# EAGLE design stepper-motor-driver (EAGLE 5.02)
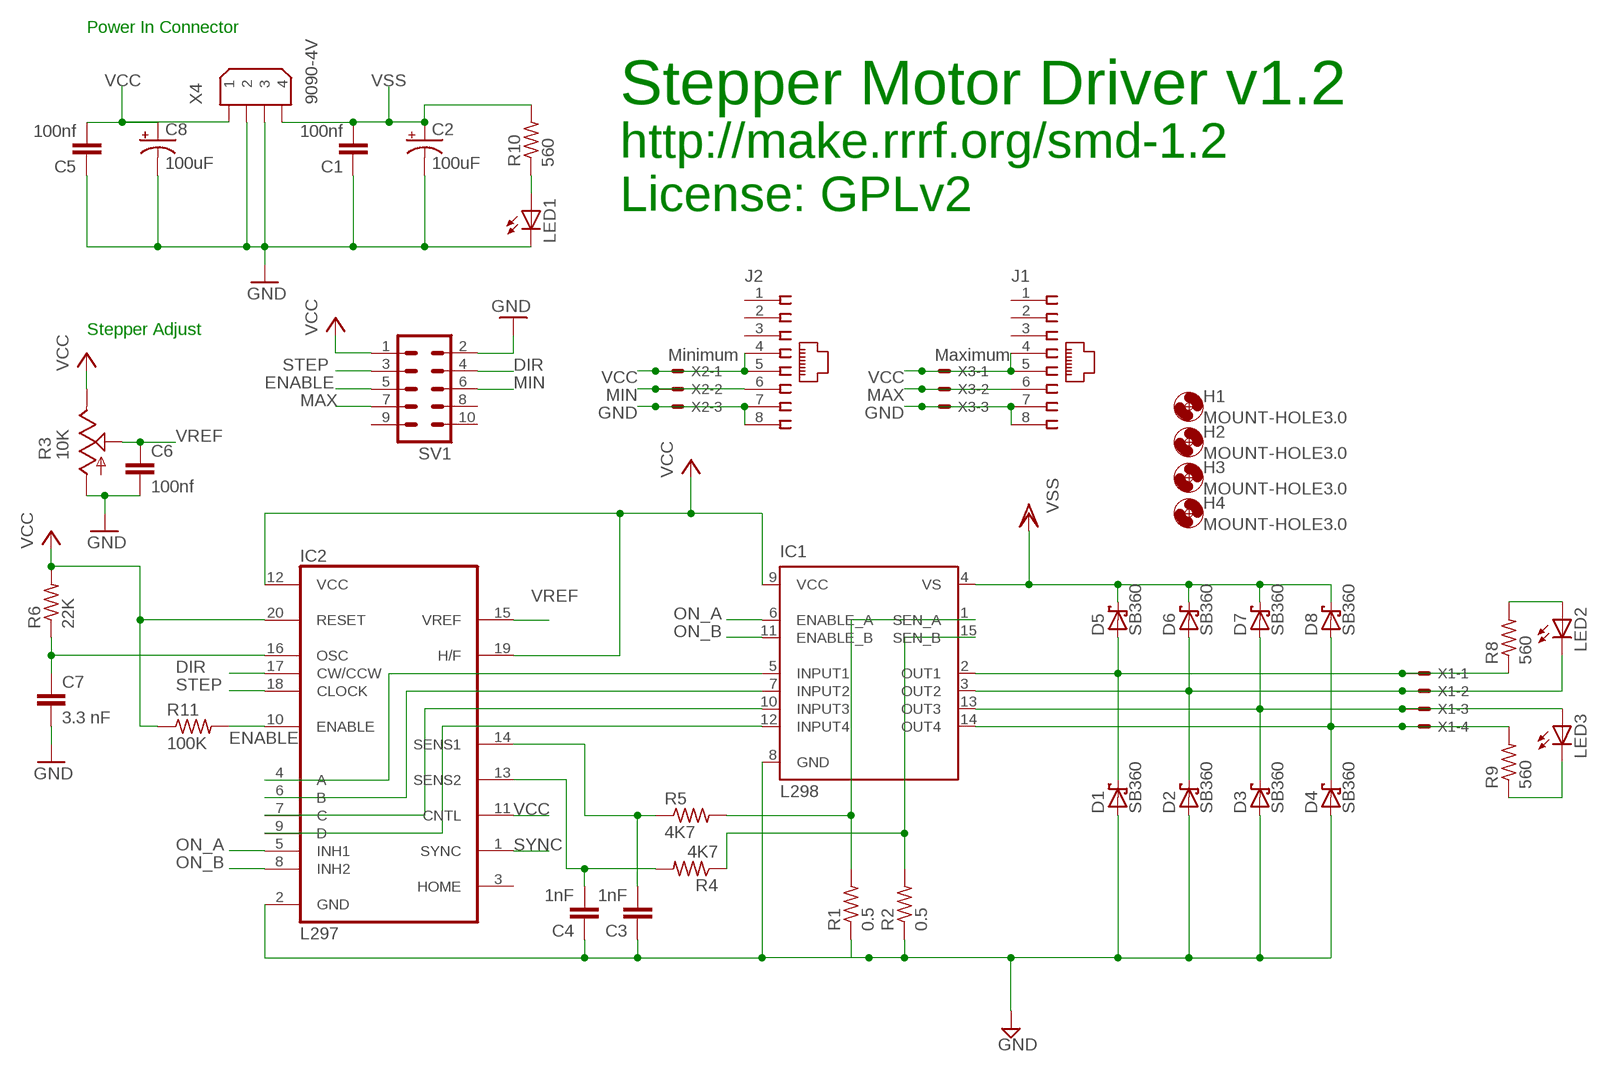
[diagram p0: schematic, sheet 1]

## Parts
C1  100nf  C-EU050-025X075  [C050-025X075]
C2  100uF  CPOL-USE5-6  [E5-6]
C3  1nF  C-EU050-030X075  [C050-030X075]
C4  1nF  C-EU050-030X075  [C050-030X075]
C5  100nf  C-EU050-025X075  [C050-025X075]
C6  100nf  C-EU050-035X075  [C050-035X075]
C7  3.3 nF  C5/2.5  [C5B2.5]
C8  100uF  CPOL-USE5-6  [E5-6]
D1  SB360  SCHOTTKY-DIODECB429-15  [CB429-15]
D2  SB360  SCHOTTKY-DIODECB429-15  [CB429-15]
D3  SB360  SCHOTTKY-DIODECB429-15  [CB429-15]
D4  SB360  SCHOTTKY-DIODECB429-15  [CB429-15]
D5  SB360  SCHOTTKY-DIODECB429-15  [CB429-15]
D6  SB360  SCHOTTKY-DIODECB429-15  [CB429-15]
D7  SB360  SCHOTTKY-DIODECB429-15  [CB429-15]
D8  SB360  SCHOTTKY-DIODECB429-15  [CB429-15]
H1  MOUNT-HOLE3.0  [3,0]
H2  MOUNT-HOLE3.0  [3,0]
H3  MOUNT-HOLE3.0  [3,0]
H4  MOUNT-HOLE3.0  [3,0]
IC1  L298  [MULTIWATT-15]
IC2  L297  [DIL20]
J1  520426-4  [520426-4]
J2  520426-4  [520426-4]
LED1  LED5MM  [LED5MM]
LED2  LED3MM  [LED3MM]
LED3  LED3MM  [LED3MM]
R1  0.5  R-US_0309/12  [0309/12]
R2  0.5  R-US_0309/12  [0309/12]
R3  10K  TRIM_US-B25U  [B25U]
R4  4K7  R-US_0207/7  [0207/7]
R5  4K7  R-US_0207/7  [0207/7]
R6  22K  R-US_0207/7  [0207/7]
R8  560  R-US_0207/7  [0207/7]
R9  560  R-US_0207/7  [0207/7]
R10  560  R-US_0207/7  [0207/7]
R11  100K  R-US_0207/7  [0207/7]
SV1  ML10  [ML10]
X1  KK-156-4  [KK-156-4]
X2  Minimum  22-23-2031  [22-23-2031]
X3  Maximum  22-23-2031  [22-23-2031]
X4  9090-4V  [9090-4V]

## Nets
DIR: IC2.17(CW/CCW) SV1.4
ENABLE: IC2.10(ENABLE) R11.2 SV1.5
GND [Ground]: C1.1 C2.- C3.1 C4.1 C5.1 C6.2 C7.2 C8.- D1.A D2.A D3.A D4.A IC1.8(GND) IC2.2(GND) J1.7 J1.8 J2.7 J2.8 LED1.K(C) R1.1 R2.1 R3.A SV1.2 X2.3 X3.3 X4.2 X4.3
MAX: J1.6 SV1.7 X3.2
MIN: J2.6 SV1.6 X2.2
N$2: LED3.K(C) R9.1
N$3: LED2.A R8.2
N$4: LED1.A R10.1
N$25: IC1.5(INPUT1) IC2.4(A)
N$26: IC1.7(INPUT2) IC2.6(B)
N$27 [Power]: D4.C D8.A IC1.14(OUT4) R9.2 X1.4
N$28 [Power]: D3.C D7.A IC1.13(OUT3) LED3.A X1.3
N$29 [Power]: D2.C D6.A IC1.3(OUT2) LED2.K(C) X1.2
N$30 [Power]: D1.C D5.A IC1.2(OUT1) R8.1 X1.1
N$31: IC1.10(INPUT3) IC2.7(C)
N$32 [Power]: IC1.15(SEN_B) R2.2 R4.1
N$33 [Power]: IC1.1(SEN_A) R1.2 R5.2
N$34: IC1.12(INPUT4) IC2.9(D)
N$36: C4.2 IC2.13(SENS2) R4.2
N$37: C3.2 IC2.14(SENS1) R5.1
ON_A: IC1.6(ENABLE_A) IC2.5(INH1)
ON_B: IC1.11(ENABLE_B) IC2.8(INH2)
OSC: C7.1 IC2.16(OSC) R6.1
STEP: IC2.18(CLOCK) SV1.3
SYNC: IC2.1(SYNC)
VCC: C5.2 C8.+ IC1.9(VCC) IC2.11(CNTL) IC2.12(VCC) IC2.19(H/F) IC2.20(RESET) J1.4 J1.5 J2.4 J2.5 R3.E R6.2 R11.1 SV1.1 X2.1 X3.1 X4.1
VREF: C6.1 IC2.15(VREF) R3.S
VSS [Power]: C1.2 C2.+ D5.C D6.C D7.C D8.C IC1.4(VS) R10.2 X4.4
Unconnected: IC2.3(HOME) J1.1 J1.2 J1.3 J2.1 J2.2 J2.3 SV1.8 SV1.9 SV1.10

## Notes on the sheet
- Power In Connector
- Stepper Motor Driver v1.2
- http://make.rrrf.org/smd-1.2
- License: GPLv2
- Stepper Adjust

## Library data of the parts
C1 C3-C6 = rcl:C-EU: CAPACITOR, European symbol
C2 C8 = rcl:CPOL-US: POLARIZED CAPACITOR, American symbol
C7 = capacitor-wima:C: CAPACITOR naming: grid - package width
D1-D8 = diode:SCHOTTKY-DIODE: Schottky Diode
H1-H4 = holes:MOUNT-HOLE: MOUNTING HOLE with drill center marker
IC1 = st-microelectronics:L298: DUAL FULL-BRIDGE DRIVER
IC2 = st-microelectronics:L297: STEPPER MOTOR CONTROLLER
J1 J2 = con-amp:520426-4: AMP connector
LED1-LED3 = led:LED: LED OSRAM: - CHIPLED LG R971, LG N971, LY N971, LG Q971, LY Q971, LO R971, LY R971 LH N974, LH R974 LS Q976, LO Q976, LY Q976 LO Q996 - Hyper CHIPLED LW Q18S LB Q993, LB Q99A, LB R99A - SideLED LS A670, LO A670, LY A670, LG A670, LP A670 LB A673, LV A673, LT A673, LW A673 LH A674 LY A675 LS A676, LA A676, LO A676, LY A676, LW A676 LS A679, LY A679, LG A679 - Hyper Micro SIDELED® LS Y876, LA Y876, LO Y876, LY Y876 LT Y87S - SmartLED LW L88C, LW L88S LB L89C, LB L89S, LG L890 LS L89K, LO L89K, LY L89K LS L896, LA L896, LO L896, LY L896 - TOPLED LS T670, LO T670, LY T670, LG T670, LP T670 LSG T670, LSP T670, LSY T670, LOP T670, LYG T670 LG T671, LOG T671, LSG T671 LB T673, LV T673, LT T673, LW T673 LH T674 LS T676, LA T676, LO T676, LY T676, LB T676, LH T676, LSB T676, LW T676 LB T67C, LV T67C, LT T67C, LS T67K, LO T67K, LY T67K, LW E67C LS E67B, LA E67B, LO E67B, LY E67B, LB E67C, LV E67C, LT E67C LW T67C LS T679, LY T679, LG T679 LS T770, LO T770, LY T770, LG T770, LP T770 LB T773, LV T773, LT T773, LW T773 LH T774 LS E675, LA E675, LY E675, LS T675 LS T776, LA T776, LO T776, LY T776, LB T776 LHGB T686 LT T68C, LB T68C - Hyper Mini TOPLED® LB M676 - Mini TOPLED Santana® LG M470 LS M47K, LO M47K, LY M47K Source: http://www.osram.convergy.de - LUMILED® LXK2-PW12-R00, LXK2-PW12-S00, LXK2-PW14-U00, LXK2-PW14-V00 LXK2-PM12-R00, LXK2-PM12-S00, LXK2-PM14-U00 LXK2-PE12-Q00, LXK2-PE12-R00, LXK2-PE12-S00, LXK2-PE14-T00, LXK2-PE14-U00 LXK2-PB12-K00, LXK2-PB12-L00, LXK2-PB12-M00, LXK2-PB14-N00, LXK2-PB14-P00, LXK2-PB14-Q00 LXK2-PR12-L00, LXK2-PR12-M00, LXK2-PR14-Q00, LXK2-PR14-R00 LXK2-PD12-Q00, LXK2-PD12-R00, LXK2-PD12-S00 LXK2-PH12-R00, LXK2-PH12-S00 LXK2-PL12-P00, LXK2-PL12-Q00, LXK2-PL12-R00 Source: www.luxeon.com
R1 R2 R4-R6 R8-R11 = rcl:R-US_: RESISTOR, American symbol
R3 = pot:TRIM_US-: POTENTIOMETER
SV1 = con-harting-ml:ML10: HARTING
X1 = con-molex:KK-156-4: KK 156 HEADER Source: http://www.molex.com/pdm_docs/sd/026604100_sd.pdf
X2 X3 = con-molex:22-23-2031: .100" (2.54mm) Center Header - 3 Pin
X4 = con-thomas-betts:9090-4: Disk Drive Power four position Source: Thomas & Betts Electronic Interconnects Eiropean Edition 1998

## Net classes
0 default: width 0.406 mm, clearance 0.381 mm
1 Power: width 1.27 mm, clearance 0.381 mm
2 Signal: width 0.406 mm, clearance 0.381 mm
3 Ground: width 1.27 mm, clearance 0.381 mm

## Board
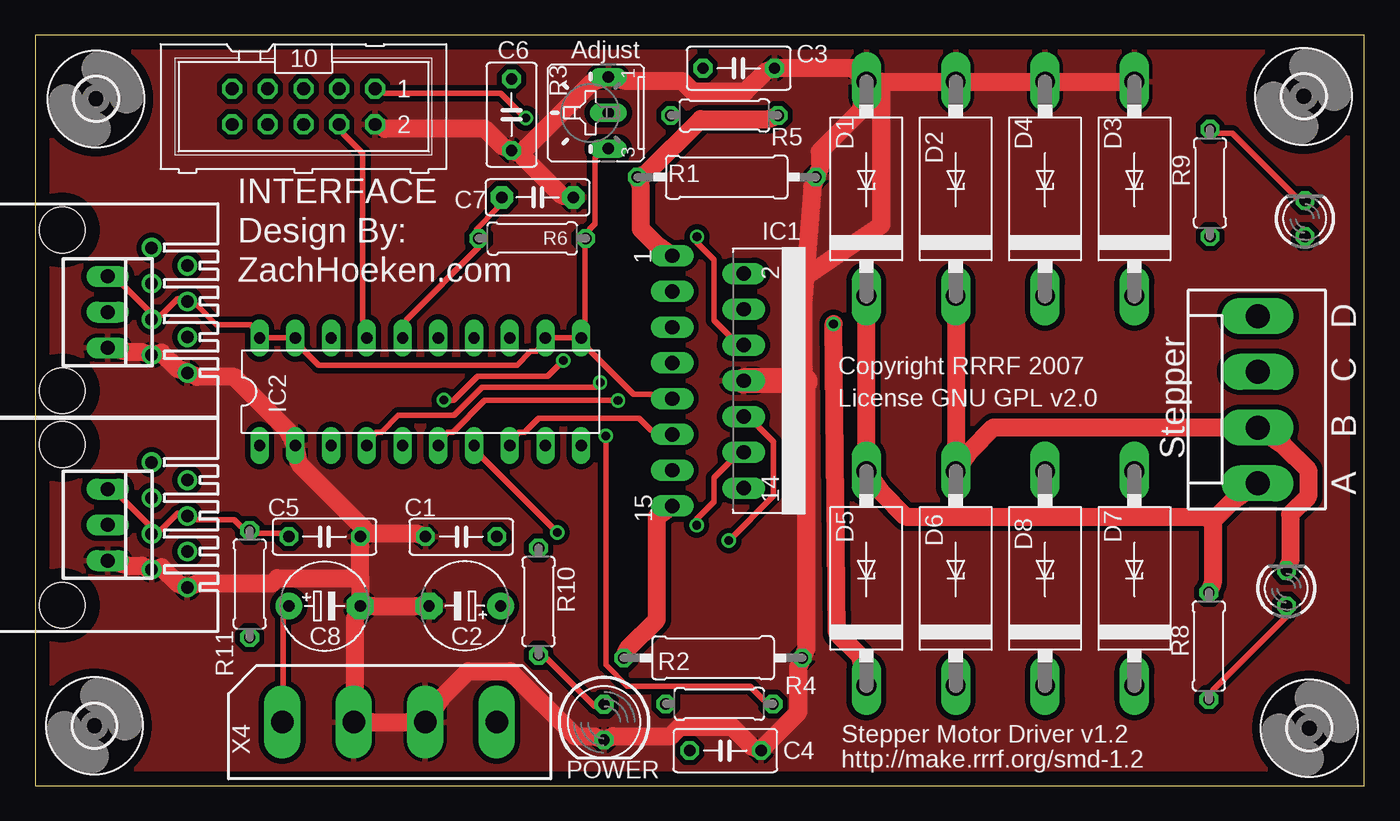
[diagram p1: board, top side]
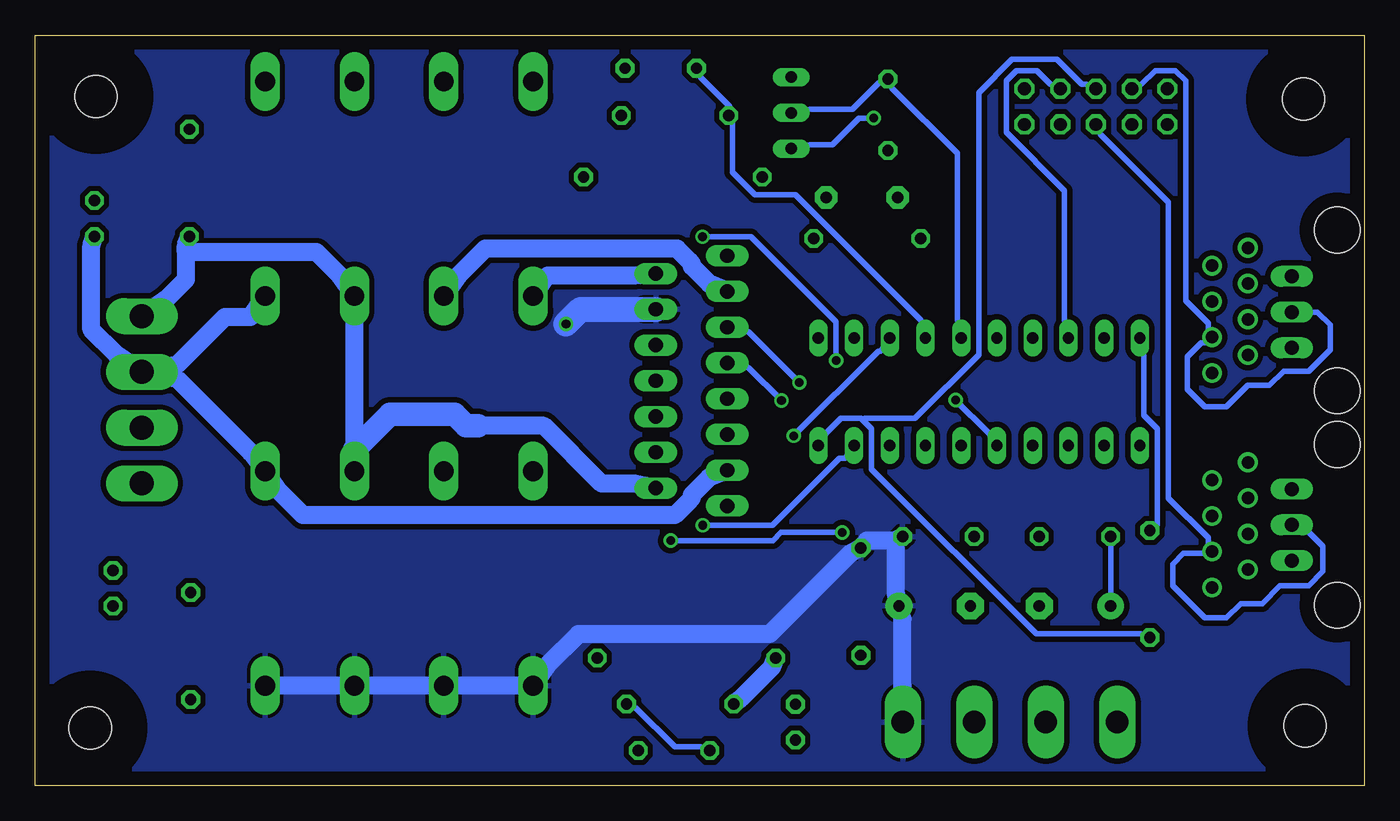
[diagram p2: board, bottom side, seen from below]

Size 94.48 x 53.33 mm. Coordinates in mm from the lower left corner, seen from the top.
Outline: 0,0 94.48,0 94.48,53.33 0,53.33 0,0
Copper layers (1*16): Top 0.035mm / dielectric 1.5mm / Bottom 0.035mm
Design rules "default": minimum track width 10mil, minimum drill 24mil, track to track 8mil, track to pad 8mil, pad to pad 8mil, via to via 8mil, smd to smd 8mil, copper to edge 40mil, drill to drill 8mil, minimum pad ring 10mil, minimum via ring 8mil, stop-mask expansion 4mil, vias tented up to drill 0mil, thermal gap 10mil

### Footprints (pad centres in the part's own frame; a part is rotated, then mirrored left to right if it is on the bottom)
C050-025X075 = drill 0.813 octagon: 1 -2.54,0; 2 2.54,0
E5-6 = drill 0.813 pad 1.905 round: + -2.54,0 | drill 0.813 pad 1.905 octagon: - 2.54,0
C050-030X075 = drill 0.813 octagon: 1 -2.54,0; 2 2.54,0
C050-035X075 = drill 0.813 octagon: 1 -2.54,0; 2 2.54,0
C5B2.5 = drill 0.813 pad 1.6 octagon: 1 -2.54,0; 2 2.54,0
CB429-15 = drill 1.397 long: A 7.62,0; C -7.62,0
3,0 = hole 3: 0,0
MULTIWATT-15 = drill 1.016 long: 1 -8.89,-7.62; 2 -7.62,-2.54; 3 -6.35,-7.62; 4 -5.08,-2.54; 5 -3.81,-7.62; 6 -2.54,-2.54; 7 -1.27,-7.62; 8 0,-2.54; 9 1.27,-7.62; 10 2.54,-2.54; 11 3.81,-7.62; 12 5.08,-2.54; 13 6.35,-7.62; 14 7.62,-2.54; 15 8.89,-7.62
DIL20 = drill 0.813 long: 1 -11.43,-3.81; 2 -8.89,-3.81; 3 -6.35,-3.81; 4 -3.81,-3.81; 5 -1.27,-3.81; 6 1.27,-3.81; 7 3.81,-3.81; 8 6.35,-3.81; 9 8.89,-3.81; 10 11.43,-3.81; 11 11.43,3.81; 12 8.89,3.81; 13 6.35,3.81; 14 3.81,3.81; 15 1.27,3.81; 16 -1.27,3.81; 17 -3.81,3.81; 18 -6.35,3.81; 19 -8.89,3.81; 20 -11.43,3.81
520426-4 = drill 0.889 round: 1 -4.445,6.35; 2 -3.175,8.89; 3 -1.905,6.35; 4 -0.635,8.89; 5 0.635,6.35; 6 1.905,8.89; 7 3.175,6.35; 8 4.445,8.89 | hole 3.251: -5.715,0; 5.715,0
LED5MM = drill 0.813 octagon: A -1.27,0; K 1.27,0
LED3MM = drill 0.813 octagon: A -1.27,0; K 1.27,0
0309/12 = drill 0.813 octagon: 1 -6.35,0; 2 6.35,0
B25U = drill 0.813 long: A 2.54,-0.889; E -2.54,-0.889; S 0,-0.889
0207/7 = drill 0.813 octagon: 1 -3.81,0; 2 3.81,0
ML10 = drill 0.914 octagon: 1 -5.08,-1.27; 2 -5.08,1.27; 3 -2.54,-1.27; 4 -2.54,1.27; 5 0,-1.27; 6 0,1.27; 7 2.54,-1.27; 8 2.54,1.27; 9 5.08,-1.27; 10 5.08,1.27
KK-156-4 = drill 1.7 pad 2.184 long: 1 -5.94,0; 2 -1.98,0; 3 1.98,0; 4 5.94,0
22-23-2031 = drill 1 long: 1 -2.54,0; 2 0,0; 3 2.54,0
9090-4V = drill 1.6 pad 2.6 long: 1 -7.62,0; 2 -2.54,0; 3 2.54,0; 4 7.62,0

### Placement (x,y rotation side)
C1  30.28,17.7 0 top
C2  30.54,12.77 180 top
C3  50.01,50.98 180 top
C4  49.05,2.5 180 top
C5  20.57,17.7 180 top
C6  33.86,47.68 270 top
C7  35.71,41.81 0 top
C8  20.57,12.77 0 top
D1  59.08,42.41 90 top
D2  65.43,42.41 90 top
D3  78.13,42.41 90 top
D4  71.78,42.41 90 top
D5  59.08,14.73 90 top
D6  65.43,14.73 90 top
D7  78.13,14.73 90 top
D8  71.78,14.73 90 top
H1  90.56,4.09 0 top
H2  90.16,48.98 0 top
H3  4.22,4.27 0 top
H4  4.33,48.8 0 top
IC1  52.89,28.77 270 top
IC2  27.38,28 0 top
J1  1.93,33.78 270 top
J2  1.93,18.54 270 top
LED1  40.44,4.52 270 top
LED2  88.93,14.03 90 top
LED3  90.25,40.3 90 top
R1  49.15,43.25 180 top
R2  48.18,9.09 180 top
R3  39.85,47.81 90 top
R4  48.63,5.82 0 top
R5  48.99,47.63 0 top
R6  35.33,38.89 0 top
R8  83.42,9.93 270 top
R9  83.5,42.84 270 top
R10  35.78,13.08 90 top
R11  15.25,14.34 270 top
SV1  19.07,48.25 180 top
X1  86.89,27.43 90 top
X2  5.15,18.54 270 top
X3  5.15,33.65 270 top
X4  25.19,4.52 0 top

### Tracks (layer width: path | path; a pad name or v marks a point on that pad's centre or on a via)
DIR
  Top 0.406: IC2.17 23.29,33.12 23.29,44.93 21.92,46.3 SV1.4
ENABLE
  Bottom 0.406: 35.62,25.97 35.76,26.11 37.21,26.11 38.18,25.14 IC2.10 | 35.62,25.97 35.03,25.37 35.03,22.5 23.32,10.79 15.9,10.79 R11.2 | SV1.5 19.76,49.83 20.07,49.83 21.84,51.61 25.04,51.61 27.41,49.25 27.41,30.63 31.93,26.11 35.48,26.11 35.62,25.97
GND
  Top 1.27: 34.52,44.88 37.46,41.93 C7.2 | 34.52,44.88 C6.2 33.22,45.44 31.98,46.68 24.84,46.68 SV1.2 | 34.52,44.88 34.92,45.33 39.55,49.96 R3.A 42.04,50.06 46,50.06 46.76,49.3 50.47,49.3 51.89,50.72 C3.1 53.19,51 58.04,51 D1.A | D3.A D4.A D2.A 60.15,50.03 | D1.A 58.65,47.95 55.78,45.08 55.78,43.89 R1.1 55.24,42.59 54.48,32.91 | 60.15,50.03 D1.A | X2.3 6.6,15.64 7.59,15.64 J2.7 8.97,15.54 10.13,14.37 J2.8 11.51,14.37 16.84,14.37 17.22,14.75 23.11,14.75 | X3.3 6.65,30.8 7.59,30.8 J1.7 8.97,30.78 10.13,29.61 J1.8 11.51,29.05 14.15,29.05 17.96,25.24 IC2.2 18.77,22.88 23.32,18.33 23.25,18.12 | 23.11,14.75 23.11,13.71 C8.- | 23.11,14.75 23.11,17.04 C5.1 23.25,18.12 | C1.1 27.1,17.93 23.85,17.93 23.25,18.12 | C2.- 27.05,12.77 24.05,12.77 C8.- | C8.- 22.71,11.83 22.71,7.11 X4.2 23.93,4.52 26.44,4.52 X4.3 29.01,6.37 30.78,8.15 33.76,8.15 38.4,3.5 39.78,3.5 LED1.K 41.07,3.53 45.16,3.53 45.82,4.19 49.53,4.19 50.95,2.76 C4.1 52.02,2.99 54.25,5.23 54.25,8.43 R2.1 54.81,9.72 54.81,28.14 54.74,28.73 54.61,29.71 54.61,36.09 60.15,39.85 60.15,50.03
  Top 1.778: 54.74,28.73 54.54,28.73 54.51,28.7 54.44,28.77 IC1.8
  pour Top: -0.61,54.61 95.91,54.61 95.91,-1.28 -0.61,-1.28
MAX
  Bottom 0.406: SV1.7 15.85,49.83 14.86,50.82 13.44,50.82 12.7,50.08 12.7,34.46 11.1,32.86 11.1,32.56 J1.6 10.82,31.74 11.07,31.49 11.58,31.49 12.6,30.48 12.6,28.19 11.33,26.92 9.8,26.92 8.28,28.44 6.76,28.44 5.74,29.46 3.96,29.46 2.44,30.98 2.44,32.76 3.33,33.65 X3.2
MIN
  Bottom 0.406: SV1.6 18.77,46.3 13.92,41.45 13.92,20.44 11.1,17.62 11.1,17.32 J2.6 10.82,16.5 12.85,16.5 13.61,15.74 13.61,14.22 11.33,11.93 9.8,11.93 8.79,12.95 7.26,12.95 5.99,14.22 3.96,14.22 2.95,15.23 2.95,17.01 4.47,18.54 X2.2
N$2
  Top 0.406: R9.1 84.15,46.38 85.09,46.38 89.61,41.85 LED3.K
N$3
  Top 0.406: R8.2 83.69,6.78 89.03,12.11 LED2.A
N$4
  Top 0.406: R10.1 36.42,8.99 39.78,5.63 LED1.A
N$25  (via drill 0.61)
  Top 0.406: v40.16,28.65 39.83,28.32 31.77,28.32 29.77,26.31 25.81,26.31 24.61,25.12 24.23,25.12 IC2.4
  Bottom 0.406: v40.16,28.65 43.76,32.25 IC1.5
N$26  (via drill 0.61)
  Top 0.406: v41.43,27.38 31.95,27.38 29.69,25.12 29.31,25.12 IC2.6
  Bottom 0.406: v41.43,27.38 43.76,29.71 IC1.7
N$27
  Bottom 1.27: 83.77,37.92 83.77,35.96 85.09,34.64 X1.4 | 83.77,37.92 83.77,38.37 R9.2 | 62.99,25.57 58.32,25.57 54.2,21.46 51.87,21.46 IC1.14 | D8.A 71.78,23.87 D4.C 72.82,36.27 74.47,37.92 83.77,37.92
  Bottom 1.676: 62.99,25.57 63.83,25.57 64.67,26.41 69.24,26.41 71.78,23.87
N$28
  Bottom 1.27: LED3.A 90.47,38.37 90.47,32.41 88.72,30.65 X1.3 | D3.C 79.17,33.32 80.98,33.32 84.35,29.94 X1.3 | IC1.13 46.58,21.89 47.8,20.67 47.8,20.44 47.95,20.29 47.95,20.26 49,19.22 75.44,19.22 77.09,20.87 D7.A 79.17,23.69 84.35,28.88 X1.3
N$29
  Top 1.27: LED2.K 89.2,15.95 89.2,19.27 90.47,20.54 90.47,22.45 88.72,24.2 X1.2 84.35,25.47 68.12,25.47 66.47,23.82 D6.A D2.C
  Bottom 1.27: IC1.3 46.56,35.66 47.8,36.9 47.8,37.1 47.95,37.26 47.95,37.28 48.84,38.17 62.48,38.17 64.39,36.27 D2.C
N$30
  Top 1.27: 83.69,18.82 83.69,14.4 R8.1 | 83.69,18.82 85.09,20.21 X1.1 | D1.C D5.A 60.12,20.87 61.87,19.12 83.13,19.12 83.69,18.82
  Bottom 1.27: IC1.2 51.87,36.27 58.04,36.27 D1.C
N$31  (via drill 0.61)
  Top 0.406: v37.11,18 31.85,23.26 IC2.7 | v49.3,17.42 52.48,20.59 52.48,24.43 51.44,25.47 IC1.10
  Bottom 0.406: v37.11,18 41.45,18 42.04,17.42 v49.3,17.42
N$32
  Top 1.27: IC1.15 44.2,19.12 44.2,11.81 42.11,9.72 R2.2
  Bottom 1.27: R4.1 44.3,6.22 42.09,8.43 R2.2
N$33
  Top 1.27: IC1.1 44.2,38.4 43.05,39.54 43.05,42.59 R1.2 43.46,43.5 47.32,47.37 52.15,47.37 R5.2
N$34  (via drill 0.61)
  Top 0.406: v47.02,18.51 47.02,18.94 48.23,20.16 48.23,21.89 49.28,22.93 IC1.12
  Bottom 0.406: v47.02,18.51 42.06,18.51 37.31,23.26 36.93,23.26 IC2.9
N$36  (via drill 0.61)
  Top 0.406: v40.56,24.86 40.56,8.58 42.06,7.08 50.8,7.08 51.79,6.09 R4.2
  Bottom 0.406: C4.2 47.17,2.76 49,2.76 51.79,5.56 R4.2 | v40.56,24.86 34.54,30.88 34.39,30.88 IC2.13
N$37
  Bottom 0.406: IC2.14 31.52,33.07 40.44,41.98 43.31,41.98 44.91,43.58 44.91,46.98 R5.1 45.13,48.28 47.19,50.34 C3.2
ON_A  (via drill 0.61)
  Top 0.406: v29.06,27.4 29.74,27.4 31.45,29.1 36.42,29.1 v37.54,30.22 | v47.04,39.01 47.04,38.58 48.23,37.38 48.23,33.09 49.28,32.05 IC1.6
  Bottom 0.406: v29.06,27.4 26.77,25.12 IC2.5 | v37.54,30.22 37.54,32.96 43.59,39.01 v47.04,39.01
ON_B
  Top 0.406: IC2.8 34.39,25.12 34.77,25.12 35.76,26.11 42.93,26.11 43.76,25.27 IC1.11
OSC
  Top 0.406: IC2.16 26.39,33.12 31.52,38.25 R6.1 31.37,39.54 32.84,41.02 C7.1
STEP
  Bottom 0.406: IC2.18 21.31,33.12 21.31,42.29 25.45,46.43 25.45,50.08 24.71,50.82 23.29,50.82 22.3,49.83 SV1.3
VCC  (via drill 0.61)
  Top 0.406: IC2.11 38.18,31.82 36.93,31.82 IC2.12 35.64,30.86 35.2,30.86 34.24,29.89 20.14,29.89 19.15,30.88 IC2.19 17.86,31.82 16.61,31.82 IC2.20 15.32,32.76 12.88,32.76 11.51,34.13 J1.4 10.13,34.59 8.97,33.42 J1.5 8,33.83 6.3,35.53 X3.1 | IC2.11 39.09,33.12 39.09,38.25 R6.2 39.39,39.54 39.8,39.95 39.8,44.62 R3.E | v34.87,47.44 33.1,49.22 24.84,49.22 SV1.1 | IC1.9 43.76,27.81 42.55,27.81 39.47,30.88 IC2.11 | X2.1 6.25,20.37 8.03,18.59 J2.5 8.97,18.18 10.13,19.35 J2.4 11.51,18.89 14.15,18.89 14.61,18.44 R11.1 15.9,17.95 17.37,17.95 C5.2 | X4.1 17.63,7.11 17.63,11.83 C8.+
  Bottom 0.406: v34.87,47.44 35.91,47.44 37.82,45.54 39.42,45.54 R3.E | C5.2 18.03,17.04 18.03,13.71 C8.+ | IC2.20 15.67,30.5 15.67,26.34 14.71,25.37 14.71,18.54 R11.1
VREF
  Bottom 0.406: IC2.15 28.93,33.12 28.93,44.93 33.58,49.58 C6.1 34.52,49.96 36.4,48.08 39.42,48.08 R3.S
VSS  (via drill 0.61)
  Top 1.27: v56.74,32.81 57,10.84 58.65,9.19 D5.C
  Bottom 1.27: 33.48,17.42 35.38,17.42 R10.2 36.4,16.58 36.45,16.58 42.27,10.77 55.85,10.77 58.04,8.58 D5.C D6.C D8.C D7.C | 33.48,17.42 C1.2 | 33.48,17.42 33.3,16.81 33.3,13.71 C2.+ 32.82,11.83 32.82,7.11 X4.4
  Bottom 1.778: IC1.4 55.7,33.85 v56.74,32.81
  pour Bottom: -0.61,54.61 95.91,54.61 95.91,-1.28 -0.61,-1.28

### Text on the board
tPlace: Adjust | INTERFACE | Design By: | ZachHoeken.com | D | C | Copyright RRRF 2007 | License GNU GPL v2.0 | B | Stepper | A | Stepper Motor Driver v1.2 | http://make.rrrf.org/smd-1.2 | POWER